# EAGLE schematic laserprojector (EAGLE 5.11)
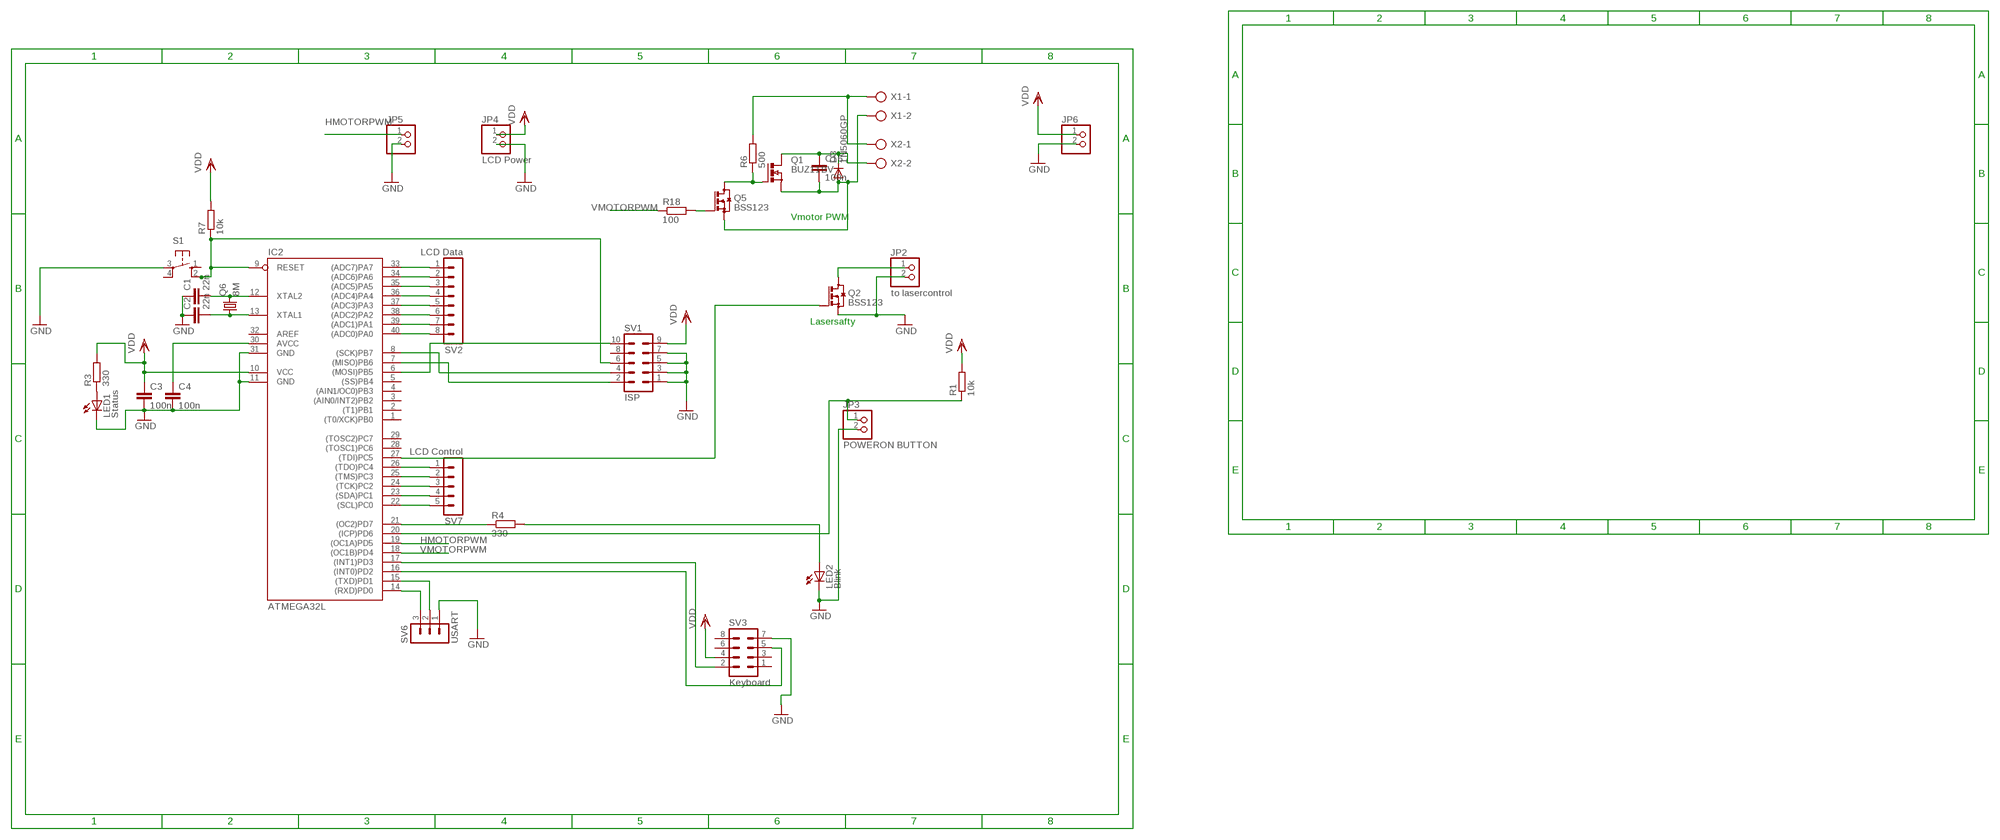
[diagram p0: schematic, sheet 1]

## Parts
C1  22n  C2.5/2  [C2.5-2]
C2  22n  C2.5/2  [C2.5-2]
C3  100n  C-EUC0805  [C0805]
C4  100n  C-EUC0805  [C0805]
C16  100n  C-EU050-025X075  [C050-025X075]
D3  1N5060GP  [DO15-12]
IC2  ATMEGA32L  MEGA32-P  [DIL40]
JP2  to lasercontrol  PINHD-1X2  [1X02]
JP3  POWERON BUTTON  PINHD-1X2  [1X02]
JP4  LCD Power  PINHD-1X2/90  [1X02/90]
JP5  PINHD-1X2  [1X02]
JP6  PINHD-1X2  [1X02]
LED1  Status  LED3MM  [LED3MM]
LED2  Blink  LED3MM  [LED3MM]
Q1  BUZ11BV  [TO220BV]
Q2  BSS123  [SOT23]
Q5  BSS123  [SOT23]
Q6  8M  CRYSTALHC49U70  [HC49U70]
R1  10k  R-EU_R0805  [R0805]
R3  330  R-EU_M0805  [M0805]
R4  330  R-EU_M0805  [M0805]
R6  500  R-EU_M0805  [M0805]
R7  10k  R-EU_M0805  [M0805]
R18  100  R-EU_M0805  [M0805]
S1  10-XX  [B3F-10XX]
SV1  ISP  ML10  [ML10]
SV2  LCD Data  MA08-1  [MA08-1]
SV3  Keyboard  MA04-2  [MA04-2]
SV6  USART  MA03-1  [MA03-1]
SV7  LCD Control  MA05-1  [MA05-1]
X1  AK500/2  [AK500/2]
X2  AK500/2  [AK500/2]

## Nets
GND: C1.1 C2.1 C3.2 C4.2 IC2.11(GND) IC2.31(GND) JP2.2 JP3.2 JP4.2 JP5.2 JP6.2 LED1.K(C) LED2.K(C) Q2.2(S) S1.3(P) SV1.1 SV1.3 SV1.5 SV1.7 SV3.7 SV6.1
HMOTORPWM: IC2.19((OC1A)PD5) JP5.1
N$2: C1.2 IC2.12(XTAL2) Q6.2
N$3: IC2.33((ADC7)PA7) SV2.1
N$4: IC2.34((ADC6)PA6) SV2.2
N$5: IC2.35((ADC5)PA5) SV2.3
N$6: IC2.36((ADC4)PA4) SV2.4
N$7: IC2.37((ADC3)PA3) SV2.5
N$8: IC2.38((ADC2)PA2) SV2.6
N$9: IC2.39((ADC1)PA1) SV2.7
N$10: IC2.40((ADC0)PA0) SV2.8
N$11: IC2.17((INT1)PD3) SV3.2
N$12: IC2.16((INT0)PD2) SV3.5
N$13: C2.2 IC2.13(XTAL1) Q6.1
N$14: IC2.22((SCL)PC0) SV7.5
N$15: IC2.20((ICP)PD6) JP3.1 R1.1
N$16: IC2.9(RESET) R7.1 S1.2(S1) SV1.6
N$17: LED1.A R3.1
N$18: IC2.21((OC2)PD7) R4.1
N$19: LED2.A R4.2
N$21: IC2.14((RXD)PD0) SV6.3
N$22: IC2.23((SDA)PC1) SV7.4
N$23: IC2.24((TCK)PC2) SV7.3
N$24: IC2.25((TMS)PC3) SV7.2
N$25: IC2.26((TDO)PC4) SV7.1
N$27: Q1.G Q5.3(D) R6.1
N$28: Q5.1(G) R18.2
N$29: IC2.8((SCK)PB7) SV1.4
N$30: R6.2 X1.1 X2.1
N$31: IC2.15((TXD)PD1) SV6.2
N$32: C4.1 IC2.30(AVCC)
N$33: C16.2 D3.A Q1.S Q5.2(S) X1.2
N$34: JP2.1 Q2.3(D)
N$36: IC2.27((TDI)PC5) Q2.1(G)
N$45: IC2.6((MOSI)PB5) SV1.10
N$48: IC2.7((MISO)PB6) SV1.2
N$53: C16.1 D3.C Q1.D X2.2
VDD: C3.1 IC2.10(VCC) JP4.1 JP6.1 R1.2 R3.2 R7.2 SV1.9 SV3.4
VMOTORPWM: IC2.18((OC1B)PD4) R18.1
Unconnected: IC2.1((T0/XCK)PB0) IC2.2((T1)PB1) IC2.3((AIN0/INT2)PB2) IC2.4((AIN1/OC0)PB3) IC2.5((SS)PB4) IC2.28((TOSC1)PC6) IC2.29((TOSC2)PC7) IC2.32(AREF) S1.1(S) S1.4(P1) SV1.8 SV3.1 SV3.3 SV3.6 SV3.8

## Notes on the sheet
- Vmotor PWM
- Lasersafty

## Library data of the parts
C1 C2 = capacitor-wima:C: CAPACITOR naming: grid - package width
C3 C4 C16 = rcl:C-EU: CAPACITOR, European symbol
D3 = diode:1N5060GP: DIODE controlled avalanche rectifier
IC2 = atmel:MEGA32-P: MICROCONTROLLER 32 Kbytes FLASH 2 Kbytes SRAM 1 Kbytes EEPROM USART 8-channel 10 bit ADC Source: www.atmel.com .. doc2503.pdf; MPN: ATMEGA32-16PU; OC_FARNELL: 1661729; OC_NEWARK: 51P1794
JP2-JP6 = pinhead:PINHD-1X2: PIN HEADER
LED1 LED2 = led:LED: LED OSRAM: - CHIPLED LG R971, LG N971, LY N971, LG Q971, LY Q971, LO R971, LY R971 LH N974, LH R974 LS Q976, LO Q976, LY Q976 LO Q996 - Hyper CHIPLED LW Q18S LB Q993, LB Q99A, LB R99A - SideLED LS A670, LO A670, LY A670, LG A670, LP A670 LB A673, LV A673, LT A673, LW A673 LH A674 LY A675 LS A676, LA A676, LO A676, LY A676, LW A676 LS A679, LY A679, LG A679 - Hyper Micro SIDELED® LS Y876, LA Y876, LO Y876, LY Y876 LT Y87S - SmartLED LW L88C, LW L88S LB L89C, LB L89S, LG L890 LS L89K, LO L89K, LY L89K LS L896, LA L896, LO L896, LY L896 - TOPLED LS T670, LO T670, LY T670, LG T670, LP T670 LSG T670, LSP T670, LSY T670, LOP T670, LYG T670 LG T671, LOG T671, LSG T671 LB T673, LV T673, LT T673, LW T673 LH T674 LS T676, LA T676, LO T676, LY T676, LB T676, LH T676, LSB T676, LW T676 LB T67C, LV T67C, LT T67C, LS T67K, LO T67K, LY T67K, LW E67C LS E67B, LA E67B, LO E67B, LY E67B, LB E67C, LV E67C, LT E67C LW T67C LS T679, LY T679, LG T679 LS T770, LO T770, LY T770, LG T770, LP T770 LB T773, LV T773, LT T773, LW T773 LH T774 LS E675, LA E675, LY E675, LS T675 LS T776, LA T776, LO T776, LY T776, LB T776 LHGB T686 LT T68C, LB T68C - Hyper Mini TOPLED® LB M676 - Mini TOPLED Santana® LG M470 LS M47K, LO M47K, LY M47K Source: http://www.osram.convergy.de LUXEON: - LUMILED® LXK2-PW12-R00, LXK2-PW12-S00, LXK2-PW14-U00, LXK2-PW14-V00 LXK2-PM12-R00, LXK2-PM12-S00, LXK2-PM14-U00 LXK2-PE12-Q00, LXK2-PE12-R00, LXK2-PE12-S00, LXK2-PE14-T00, LXK2-PE14-U00 LXK2-PB12-K00, LXK2-PB12-L00, LXK2-PB12-M00, LXK2-PB14-N00, LXK2-PB14-P00, LXK2-PB14-Q00 LXK2-PR12-L00, LXK2-PR12-M00, LXK2-PR14-Q00, LXK2-PR14-R00 LXK2-PD12-Q00, LXK2-PD12-R00, LXK2-PD12-S00 LXK2-PH12-R00, LXK2-PH12-S00 LXK2-PL12-P00, LXK2-PL12-Q00, LXK2-PL12-R00 Source: www.luxeon.com KINGBRIGHT: KA-3528ASYC Source: www.kingbright.com
Q1 = transistor-power:BUZ11: N-CHANNEL MOS FET
Q2 Q5 = transistor-small-signal:BSS123: N-CHANNEL MOS FET
Q6 = crystal:CRYSTAL: CRYSTAL; OC_FARNELL: unknown; OC_NEWARK: unknown
R1 R6 R18 = resistor:R-EU_: RESISTOR, European symbol
R3 R4 R7 = rcl:R-EU_: RESISTOR, European symbol
S1 = switch-omron:10-XX: OMRON SWITCH
SV1 = con-harting-ml:ML10: HARTING
SV2 = con-lstb:MA08-1: PIN HEADER
SV3 = con-lstb:MA04-2: PIN HEADER
SV6 = con-lstb:MA03-1: PIN HEADER
SV7 = con-lstb:MA05-1: PIN HEADER
X1 X2 = con-ptr500:AK500/2: CONNECTOR; OC_FARNELL: unknown; OC_NEWARK: unknown

## Net classes
0 default: clearance 0.254 mm